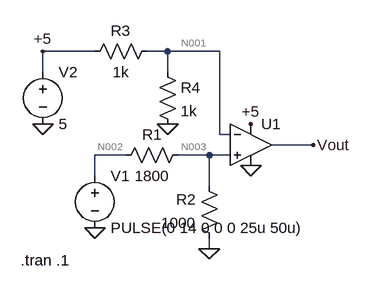
[diagram p0: schematic Draft3.asc]
Draft3.asc, the LTspice schematic file:
Version 4
SHEET 1 880 680
WIRE 0 80 -80 80
WIRE 112 80 80 80
WIRE 192 80 112 80
WIRE -80 112 -80 80
WIRE 112 112 112 80
WIRE 192 208 192 80
WIRE 208 208 192 208
WIRE 336 224 272 224
WIRE 48 240 0 240
WIRE 176 240 128 240
WIRE 208 240 176 240
WIRE 0 272 0 240
WIRE 176 288 176 240
WIRE 176 384 176 368
FLAG 176 384 0
FLAG 0 352 0
FLAG 240 256 0
FLAG 112 192 0
FLAG -80 192 0
FLAG 240 192 +5
FLAG -80 80 +5
FLAG 336 224 Vout
SYMBOL OpAmps\\UniversalOpamp2 240 224 R0
SYMATTR InstName U1
SYMBOL voltage 0 256 R0
WINDOW 123 0 0 Left 0
WINDOW 39 0 0 Left 0
SYMATTR InstName V1
SYMATTR Value PULSE(0 14 0 0 0 25u 50u)
SYMBOL res 144 224 R90
WINDOW 0 0 56 VBottom 2
WINDOW 3 32 56 VTop 2
SYMATTR InstName R1
SYMATTR Value 1800
SYMBOL res 192 384 R180
WINDOW 0 36 76 Left 2
WINDOW 3 36 40 Left 2
SYMATTR InstName R2
SYMATTR Value 1000
SYMBOL res 96 64 R90
WINDOW 0 0 56 VBottom 2
WINDOW 3 32 56 VTop 2
SYMATTR InstName R3
SYMATTR Value 1k
SYMBOL res 96 96 R0
SYMATTR InstName R4
SYMATTR Value 1k
SYMBOL voltage -80 96 R0
WINDOW 123 0 0 Left 0
WINDOW 39 0 0 Left 0
SYMATTR InstName V2
SYMATTR Value 5
TEXT -114 402 Left 2 !.tran .1

The netlist it stands for:
* Draft3.asc
XU1 N003 N001 +5 0 Vout level.2 Avol=1Meg GBW=10Meg Slew=10Meg ilimit=25m rail=0 Vos=0 phimargin=45 en=0 enk=0 in=0 ink=0 Rin=500Meg  ; pins IN+ IN- V+ V- OUT
V1 N002 0 PULSE(0 14 0 0 0 25u 50u)
R1 N003 N002 1800
R2 0 N003 1000
R3 N001 +5 1k
R4 N001 0 1k
V2 +5 0 5
.tran .1
.lib UniversalOpamps2.sub
.backanno
.end

* Results of the author's LTspice run, read from the files saved beside the schematic
* Operating Point, zero values left out:
*   V(vout) = 5.364 µV
*   V(+5) = 5 V
*   V(n001) = 2.5 V
*   V(n003) = 3.214 µV
*   I(R4) = 2.5 mA
*   I(R3) = -2.5 mA
*   I(R2) = -3.214 nA
*   I(R1) = 1.786 nA
*   I(V2) = -2.501 mA
*   I(V1) = 1.786 nA
*   Ix(u1:1) = -5 nA
*   Ix(u1:3) = 613 nA
*   Ix(u1:4) = -457.7 nA
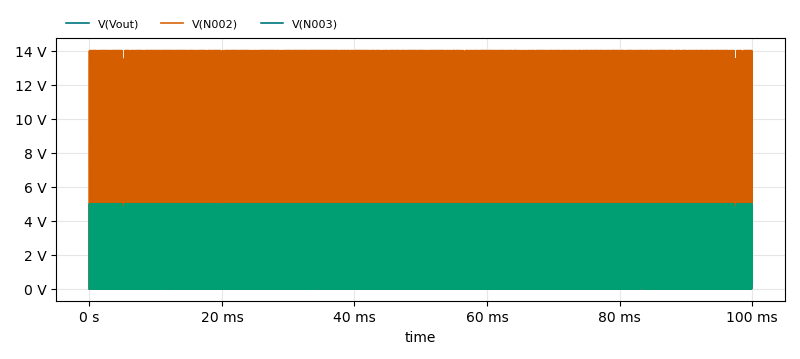
[diagram p1: Transient Analysis of Draft3.asc, plotted from the saved traces]
* Transient Analysis, 1 run:
*   V(Vout): min -117.2 µV, max 5 V, average 2.748 V, rms 3.696 V, last 5.364 µV
*   V(N002): min 0 V, max 14.03 V, average 7.7 V, rms 10.23 V, last 0 V
*   V(N003): min 3.214 µV, max 5.01 V, average 2.75 V, rms 3.654 V, last 3.214 µV